# Altium schematic sheet 02_PowerSupply.SchDoc
size A4
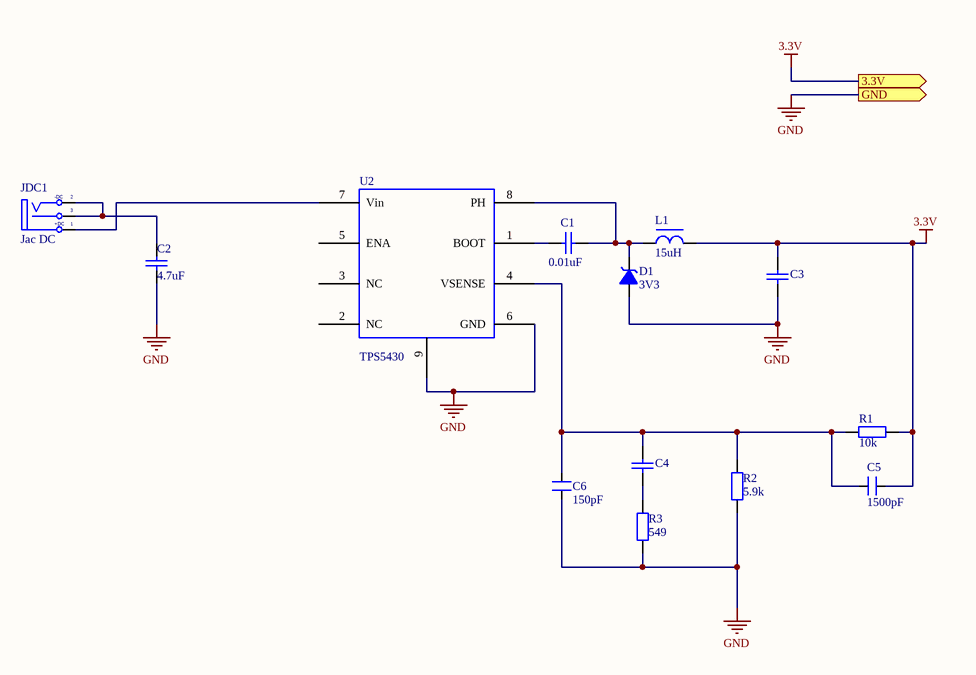
[diagram p0: 02_PowerSupply.SchDoc]

## Parts
C1  0.01uF  [C0805]
C2  4.7uF  [C0805]
C3  Capacitor Ceramic  [C0805]  (value not drawn)
C4  Capacitor Ceramic  [C0805]  (value not drawn)
C5  1500pF  [CN1]
C6  150pF  [CN1]
D1  3V3  [DZ0.5A]
JDC1  Jac DC  [DC-IN]
L1  15uH  [L-DIP-M-5.3]
R1  value 10k  [DIEN TRO 0805]  (hidden comment: R0805)
R2  5.9k  [DIEN TRO 0805]
R3  value 549  [DIEN TRO 0805]  (hidden comment: R0805)
U2  TPS5430  [TPS5430-2]

## Ports
3.3V (out), GND (out)

## Nets
3.3V: C3.2 C5.2 L1.2 R1.2 ; port 3.3V
GND: C2.1 C3.1 C6.1 D1.1(A) R2.1 R3.1 U2.6(GND) U2.9(PWR_PAD) ; port GND
NetC1_1: C1.1 D1.2(K) L1.1 U2.8(PH)
NetC1_2: C1.2 U2.1(BOOT)
NetC2_2: C2.2 JDC1.2(TN) JDC1.3(S)
NetC4_1: C4.1 R3.2
NetC4_2: C4.2 C5.1 C6.2 R1.1 R2.2 U2.4(VSENSE)
NetJDC1_1: JDC1.1(T) U2.7(Vin)

Not connected (* = marked no-connect by the designer): U2 2(NC) 3(NC) 5(ENA)

## Notes on the sheet
- Project:
- MANDevices
- Page Contents:
- Size:
- Date:
- A4
- Checked by:
- Time:
- Revision:
- Sheet
- of
- HaNoi University of
- Science and Technology
- File:
- (in symbol DCIN) -DC; +DC

## Library data of the parts
C1-C4 = CapSMD: Capacitor; Value: 33p; Published: 8-Jun-2000; LatestRevisionDate: 17-Jul-2002; LatestRevisionNote: Re-released for DXP Platform.; PackageReference: RAD-0.3; Publisher: Altium Limited
C5 C6 = CN1: Cap np  1pF - 472pF; Value: 100pF
D1 = DZ: Diode Zenner; Value: 3v3
JDC1 = DCIN: Jac DC input; Value: Jac DC
L1 = L-DIP-1: Inductor; Value: 150 mH
R1-R3 = R0805: Resistor SMD 0805; Published: 8-Jun-2000; LatestRevisionDate: 17-Jul-2002; LatestRevisionNote: Re-released for DXP Platform.; PackageReference: AXIAL-0.4; Publisher: Altium Limited
  R2: Value: 5.9k
U2 = TPS5430: Name: TPS5430